# EAGLE design TempestDrone2 (EAGLE 6.6.0)

## Sheet 1 of 3
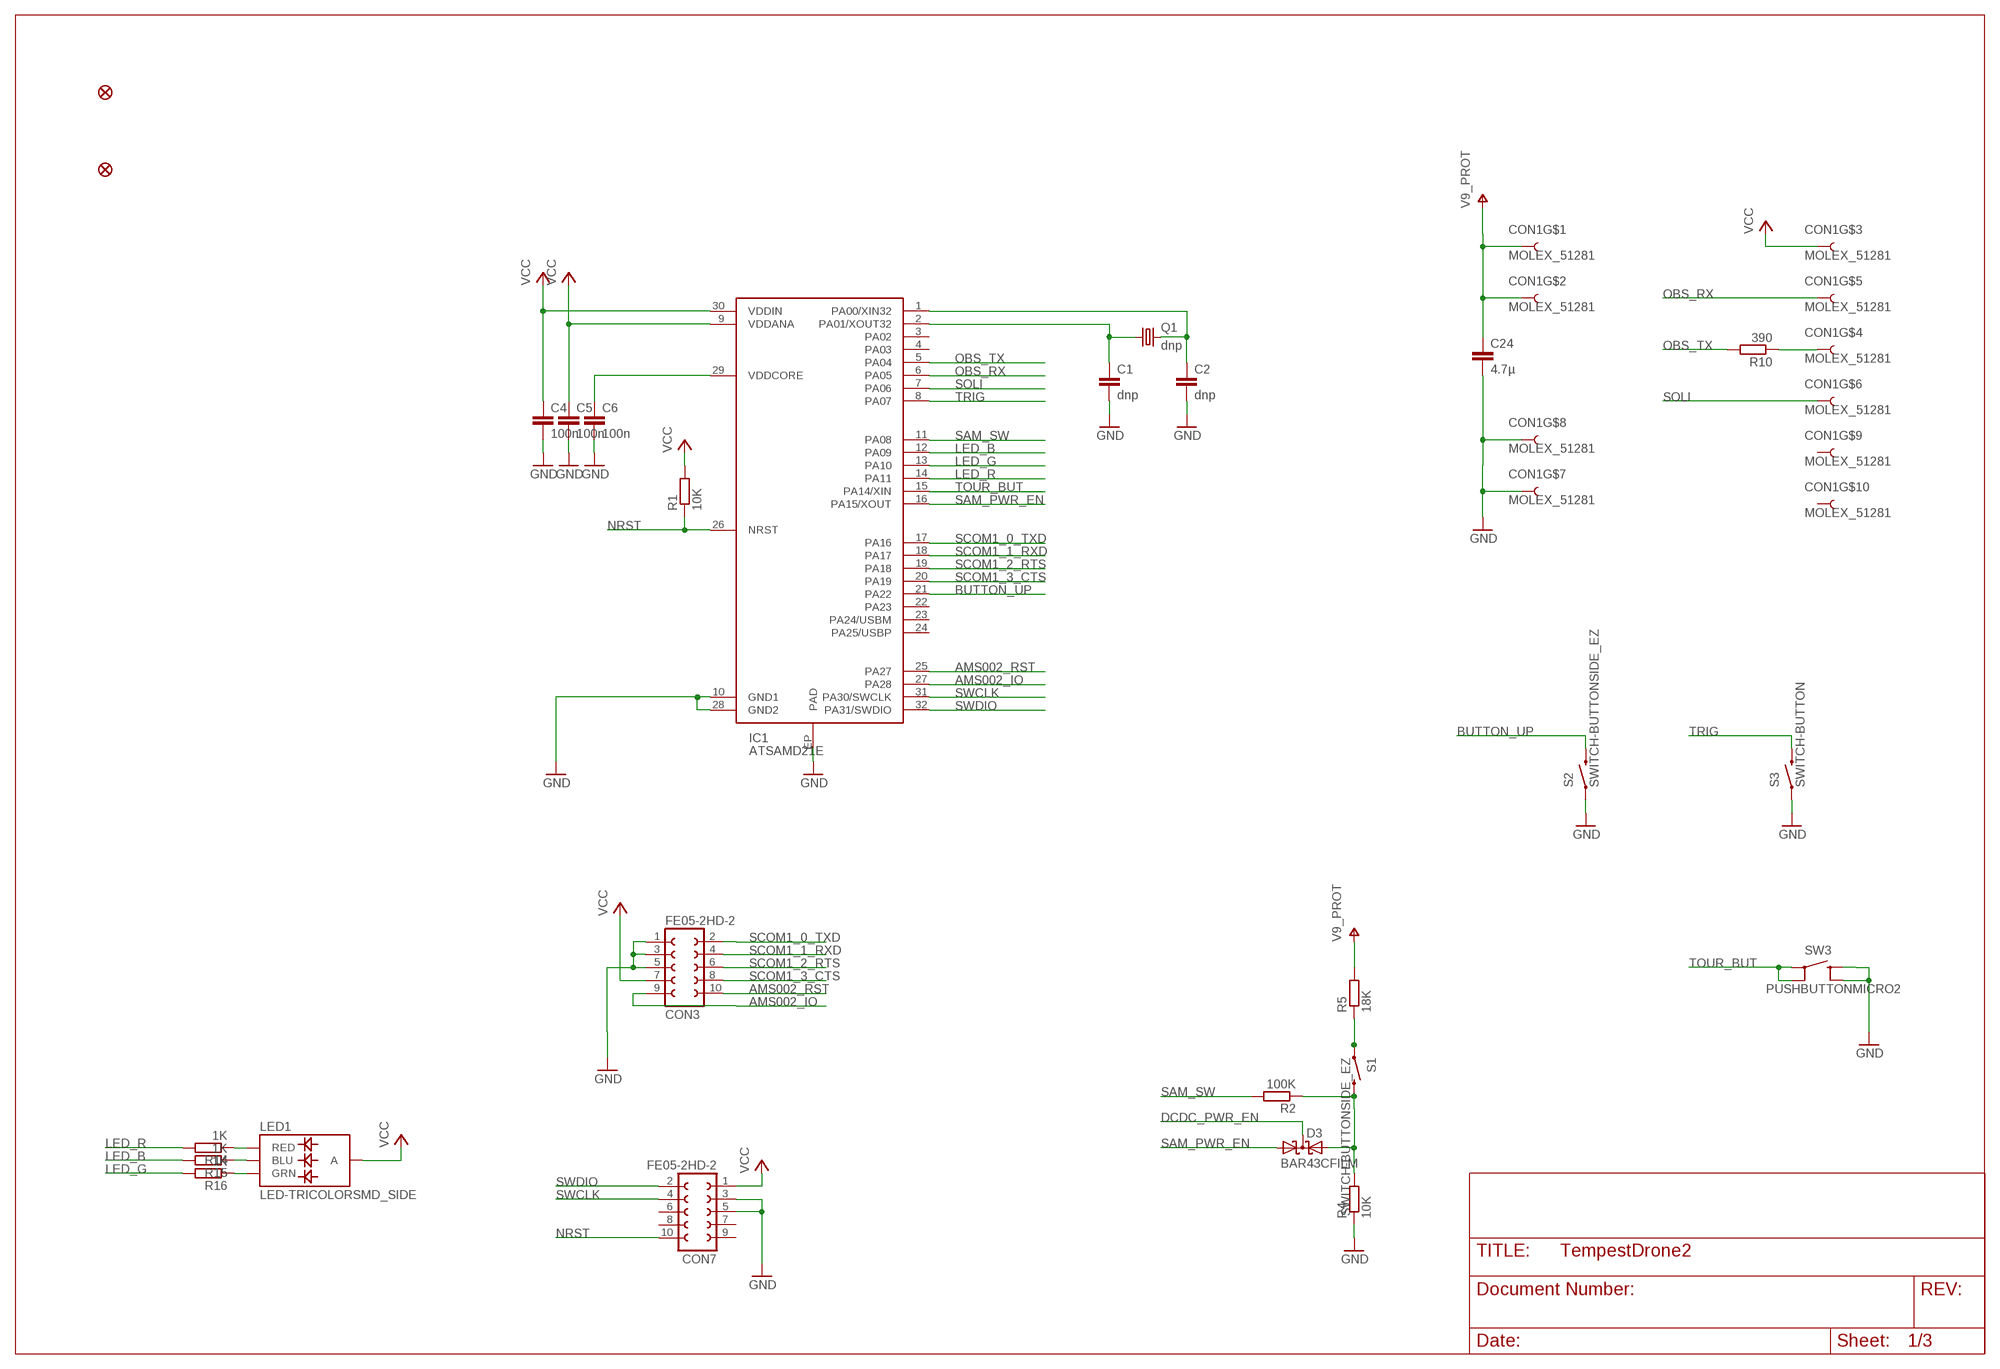
[diagram p0: schematic, sheet 1]

### Parts
C1  dnp  C0603  [_0603MP]
C2  dnp  C0603  [_0603MP]
C4  100n  C0603  [_0603MP]
C5  100n  C0603  [_0603MP]
C6  100n  C0603  [_0603MP]
C24  4.7µ  C-EUC1206  [C1206]
CON1  MOLEX_51281  [MOLEX_51281]
CON3  FE05-2HD-2  [FE02-2-HD-2]
CON7  FE05-2HD-2  [FE02-2-HD-2]
D3  BAR43CFILM  BAT54C  [SOT23]
FID1  FIDUCIALUFIDUCIAL  [MICRO-FIDUCIAL]
FID6  FIDUCIALUFIDUCIAL  [MICRO-FIDUCIAL]
IC1  ATSAMD21E  [QFN-32]
LED1  LED-TRICOLORSMD_SIDE  [RGB-LED-SMD-SIDE]
Q1  dnp  CRYSTAL32X15  [XTAL_32X15]
R1  10K  R0603  [_0603MP]
R2  100K  R0603  [_0603MP]
R4  10K  R0603  [_0603MP]
R5  18K  R0603  [_0603MP]
R10  390  R0603  [_0603MP]
R14  1K  R0603  [_0603MP]
R15  1K  R0603  [_0603MP]
R16  1K  R0603  [_0603MP]
S1  SWITCH-BUTTONSIDE_EZ  [TACTILE-PTH-SIDEEZ]
S2  SWITCH-BUTTONSIDE_EZ  [TACTILE-PTH-SIDEEZ]
S3  SWITCH-BUTTON  [D2F-A]
SW3  PUSHBUTTONMICRO2  [PUSHBUTTON-MICRO2]

### Nets
AMS002_IO: CON3.9 IC1.27(PA28)
AMS002_RST: CON3.10 IC1.25(PA27)
BUTTON_UP: IC1.21(PA22) S2.2
DCDC_PWR_EN: D3.3(CC) ; also sheet 3
GND: C1.2 C2.2 C4.2 C5.2 C6.2 C24.2 CON1.7 CON1.8 CON3.1 CON3.3 CON3.5 CON7.3 CON7.5 IC1.10(GND1) IC1.28(GND2) IC1.EP(PAD) R4.1 S2.1 S3.COM SW3.2A SW3.2B(2A) ; also sheet 3
LED_B: IC1.12(PA09) R15.2
LED_G: IC1.13(PA10) R16.2
LED_R: IC1.14(PA11) R14.2
N$1: C2.1 IC1.1(PA00/XIN32) Q1.2
N$2: C6.1 IC1.29(VDDCORE)
N$3: C1.1 IC1.2(PA01/XOUT32) Q1.1
N$5: D3.2(A2) R2.1 R4.2 S1.2
N$6: CON1.4 R10.1
N$7: R5.1 S1.1
N$30: LED1.1(RED) R14.1
N$31: LED1.3(BLU) R15.1
N$32: LED1.2(GRN) R16.1
NRST: CON7.10 IC1.26(NRST) R1.1
OBS_RX: CON1.5 IC1.6(PA05)
OBS_TX: IC1.5(PA04) R10.2
SAM_PWR_EN: D3.1(A1) IC1.16(PA15/XOUT)
SAM_SW: IC1.11(PA08) R2.2
SCOM1_0_TXD: CON3.2 IC1.17(PA16)
SCOM1_1_RXD: CON3.4 IC1.18(PA17)
SCOM1_2_RTS: CON3.6 IC1.19(PA18)
SCOM1_3_CTS: CON3.8 IC1.20(PA19)
SOLI: CON1.6 IC1.7(PA06)
SWCLK: CON7.4 IC1.31(PA30/SWCLK)
SWDIO: CON7.2 IC1.32(PA31/SWDIO)
TOUR_BUT: IC1.15(PA14/XIN) SW3.1A SW3.1B(1A)
TRIG: IC1.8(PA07) S3.NO
V9_PROT: C24.1 CON1.1 CON1.2 R5.2 ; also sheet 3
VCC: C4.1 C5.1 CON1.3 CON3.7 CON7.1 IC1.9(VDDANA) IC1.30(VDDIN) LED1.4(A) R1.2 ; also sheet 3
Unconnected: CON1.9 CON1.10 CON7.6 CON7.7 CON7.8 CON7.9 IC1.3(PA02) IC1.4(PA03) IC1.22(PA23) IC1.23(PA24/USBM) IC1.24(PA25/USBP)

## Sheet 2 of 3
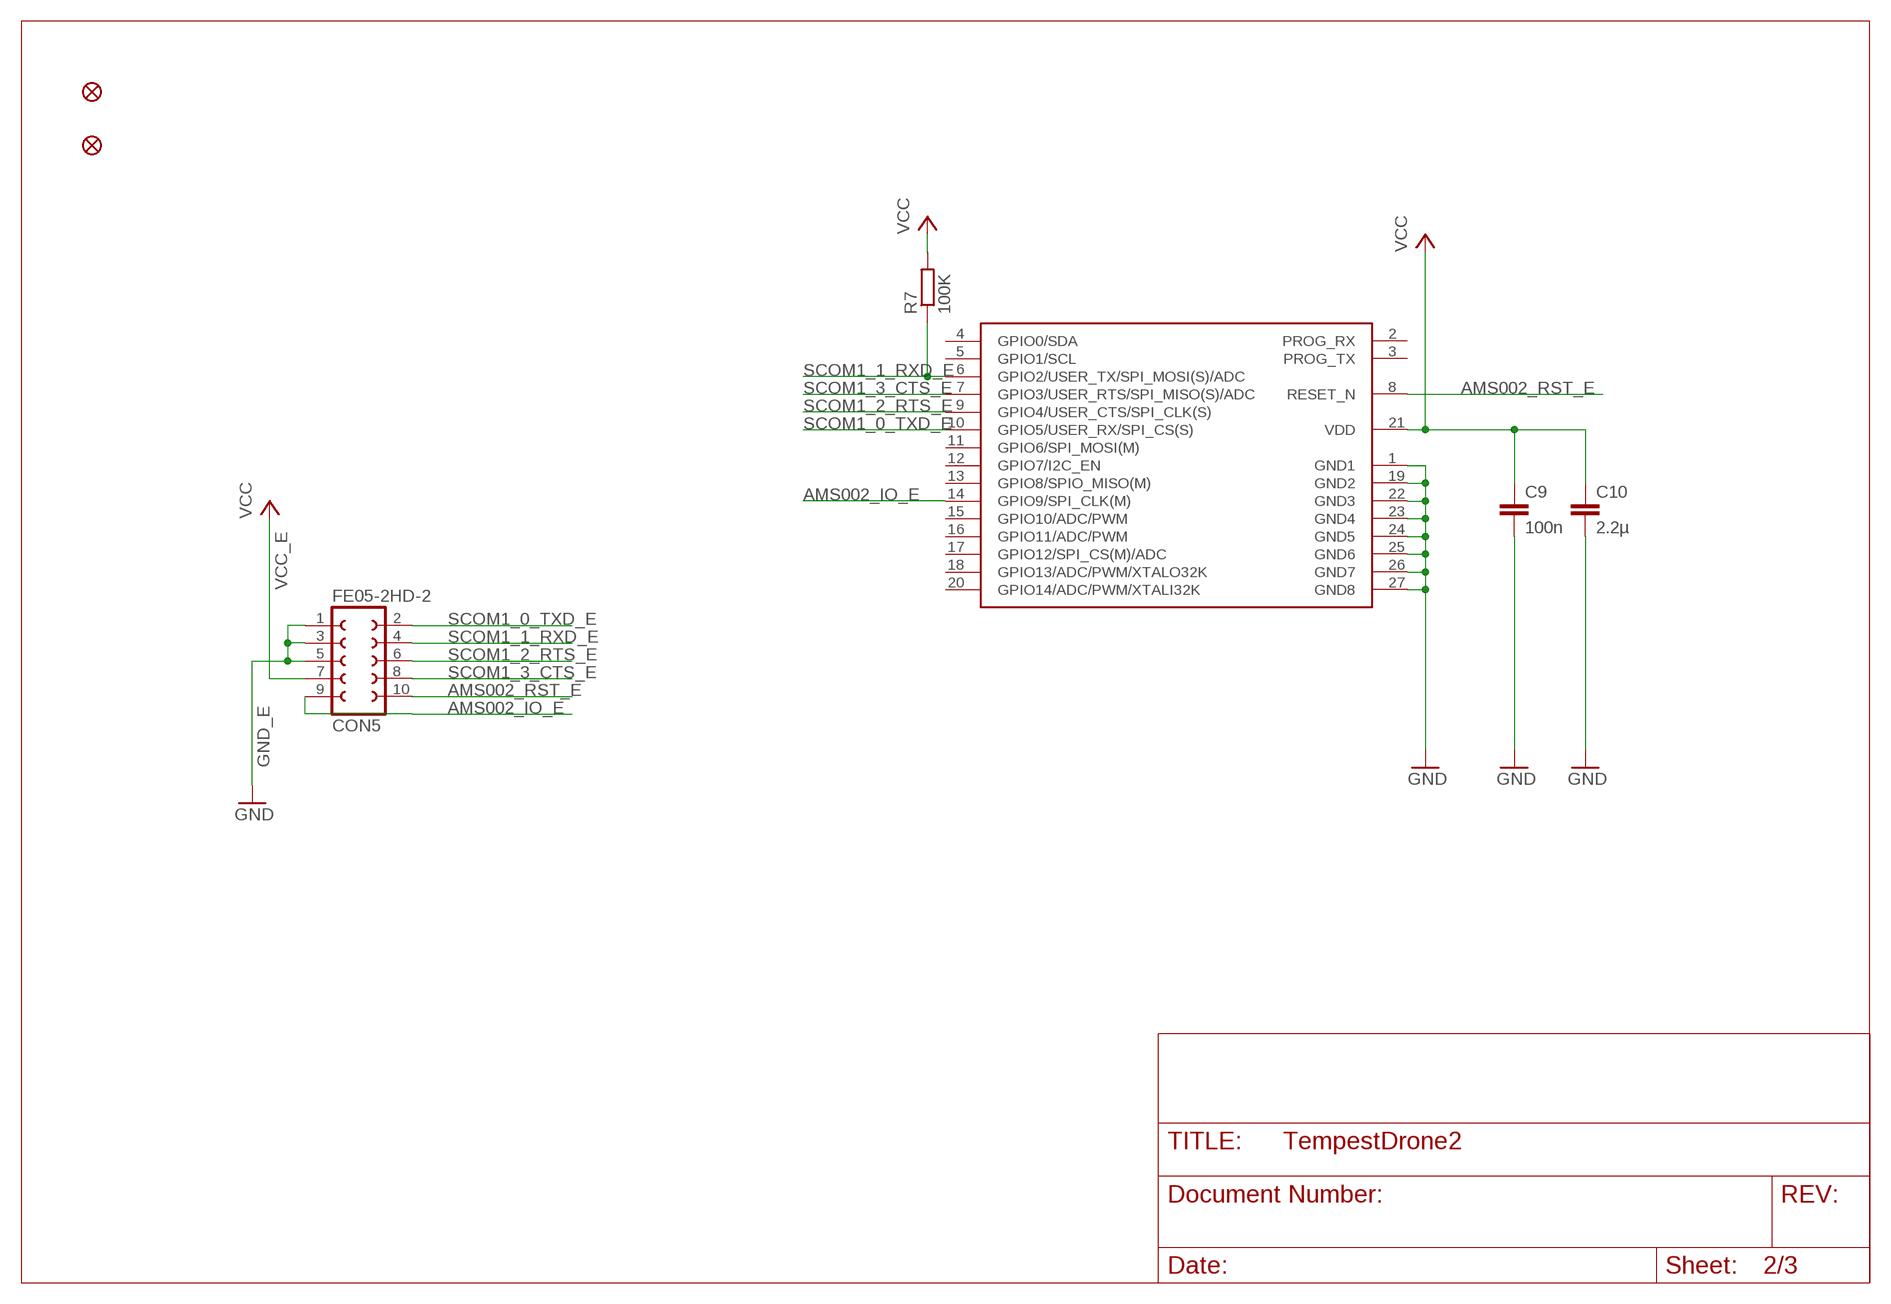
[diagram p1: schematic, sheet 2]

### Parts
C9  100n  C0603  [_0603MP]
C10  2.2µ  C0603  [_0603MP]
CON5  FE05-2HD-2  [FE02-2-HD-2]
FID3  FIDUCIALUFIDUCIAL  [MICRO-FIDUCIAL]
FID5  FIDUCIALUFIDUCIAL  [MICRO-FIDUCIAL]
R7  100K  R0603  [_0603MP]
U$1  AMS002  [AMS00X]

### Nets
AMS002_IO_E: CON5.9 U$1.14(GPIO9/SPI_CLK(M))
AMS002_RST_E: CON5.10 U$1.8(RESET_N)
GND_E: C9.2 C10.2 CON5.1 CON5.3 CON5.5 U$1.1(GND1) U$1.19(GND2) U$1.22(GND3) U$1.23(GND4) U$1.24(GND5) U$1.25(GND6) U$1.26(GND7) U$1.27(GND8) ; supply symbol labelled GND
SCOM1_0_TXD_E: CON5.2 U$1.10(GPIO5/USER_RX/SPI_CS(S))
SCOM1_1_RXD_E: CON5.4 R7.1 U$1.6(GPIO2/USER_TX/SPI_MOSI(S)/ADC)
SCOM1_2_RTS_E: CON5.6 U$1.9(GPIO4/USER_CTS/SPI_CLK(S))
SCOM1_3_CTS_E: CON5.8 U$1.7(GPIO3/USER_RTS/SPI_MISO(S)/ADC)
VCC_E: C9.1 C10.1 CON5.7 R7.2 U$1.21(VDD) ; supply symbol labelled VCC
Unconnected: U$1.2(PROG_RX) U$1.3(PROG_TX) U$1.4(GPIO0/SDA) U$1.5(GPIO1/SCL) U$1.11(GPIO6/SPI_MOSI(M)) U$1.12(GPIO7/I2C_EN) U$1.13(GPIO8/SPIO_MISO(M)) U$1.15(GPIO10/ADC/PWM) U$1.16(GPIO11/ADC/PWM) U$1.17(GPIO12/SPI_CS(M)/ADC) U$1.18(GPIO13/ADC/PWM/XTALO32K) U$1.20(GPIO14/ADC/PWM/XTALI32K)

## Sheet 3 of 3
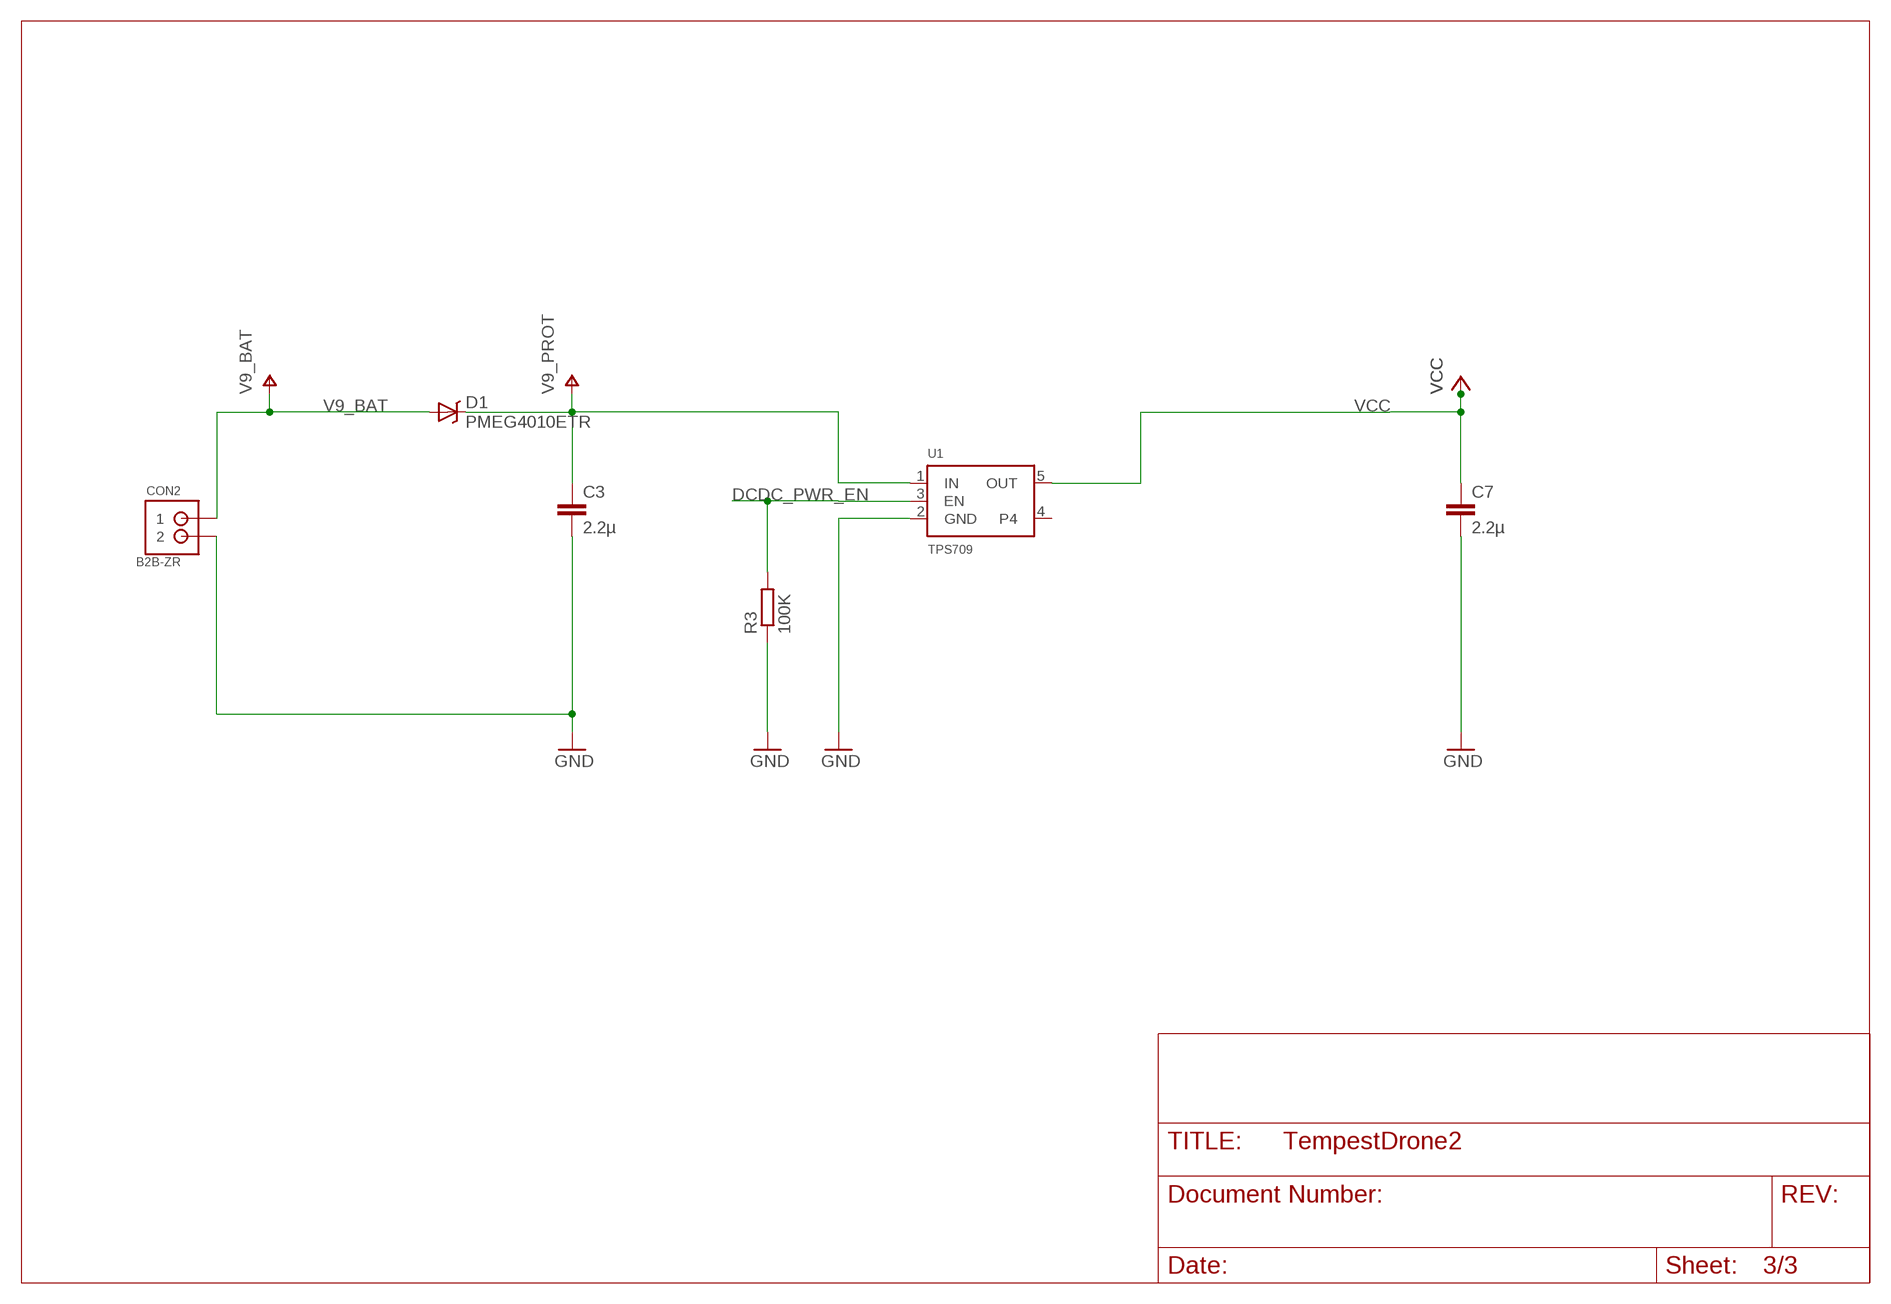
[diagram p2: schematic, sheet 3]

### Parts
C3  2.2µ  C-EUC0805  [C0805]
C7  2.2µ  C-EUC0805  [C0805]
CON2  B2B-ZR  [S2B-ZR]
D1  PMEG4010ETR  DIODE-SCHOTTKYSOD123  [SOD123]
R3  100K  R0603  [_0603MP]
U1  TPS709  VREG_SOT23-5  [SOT23-5]

### Nets
DCDC_PWR_EN: R3.2 U1.3(EN) ; also sheet 1
GND: C3.2 C7.2 CON2.2 R3.1 U1.2(GND) ; also sheet 1
V9_BAT: CON2.1 D1.A
V9_PROT: C3.1 D1.C U1.1(IN) ; also sheet 1
VCC: C7.1 U1.5(OUT) ; also sheet 1
Unconnected: U1.4

## Library data of the parts
C1 C2 C4-C6 C9 C10 = squirrel:C
C3 C7 C24 = squirrel:C-EU: CAPACITOR, European symbol
CON1 = squirrel:MOLEX_51281
CON2 = squirrel:B2B-ZR
CON3 CON5 CON7 = squirrel:FE05-2: FEMALE HEADER
D1 = squirrel:DIODE-SCHOTTKY: Commonly MBRA140.
D3 = diode:BAT54C: Schottky Diodes Source: Fairchild .. BAT54.pdf
FID1 FID3 FID5 FID6 = squirrel:FIDUCIAL: Fiducial Alignment Points Various fiducial points for machine vision alignment.
IC1 = squirrel:ATSAMD21E
LED1 = squirrel:LED-TRICOLOR: Tri-Color LED SMD Proven layout and schematic for triple color LED in SMD package - common anode. Spark Fun Electronics SKU : COM-07844
Q1 = squirrel:CRYSTAL: CRYSTAL
R1-R5 R7 R10 R14-R16 = squirrel:R
S1-S3 = squirrel:SWITCH-BUTTON: Various NO switches- pushbuttons, reed, etc
SW3 = squirrel:PUSHBUTTON
U1 = squirrel:VREG_SOT23-5: SOT23-5 Fixed Voltage Regulators Part Current Out V Out V In V Dropout ?JA (°C/W) TJ (°C) Digikey Part No. ADP121 150mA 3.3V 3.4-5.5V 0.09V @ 150mA -- -- ADP121-AUJZ33R7CT-ND ADP121 150mA 3.0V 3.1-5.5V 0.09V @ 150mA -- -- ADP121-AUJZ30R7CT-ND ADP122 300mA 3.3V 3.4-5.5V 0.085V @ 300mA -- -- ADP122AUJZ-3.3-R7CT-ND ADP1712 300mA 3.3V 3.5-5.5V 0.17V @ 300mA -- -- ADP1712AUJZ-3.3-R7TR-ND AP7311 (Low Cost) 150mA 3.3V 3.5-6V 0.15V @ 150mA -- -- AP7311-33WG-7DICT-ND LD39015M18R 150mA 1.8V 1.9V-5.5V 0.08V @ 100mA -- -- 497-6977-1-ND LP2985A-33DBVR 150mA 3.3V 3.3-16V 0.28V @ 150mA 206 150 296-18479-1-ND MCP1824T-3302E/OT 300mA 3.3V 3.5V-6V 0.2V @ 300mA -- -- MCP1824T-3302E/OTCT-ND MIC5205-2.5YM5 TR 150mA 2.5V 2.7-16V 0.165V @ 150mA -- -- 576-1257-2-ND MIC5205-3.0YM5 TR 150mA 3.0V 3.2V-16V 0.165V @ 150mA -- -- 576-1258-2-ND MIC5205-3.3YM5 TR 150mA 3.3V 3.5V-16V 0.165V @ 150mA -- -- 576-1259-2-ND TPS780330220 150mA 3.3V+2.2V 3.6-5.5V 250mV Max -- -- 296-23332-1-ND TDA3663/N1,135 100mA 3.3V 3.5-45V 0.18V @ 50mA -- -- 568-5343-1-ND Max operating temp can be calculated using ?JA, TJ (max junction temperature), and power in watts. Set the "Maximum Ambient Temperature" until it reaches TJ ("Max Junction Temperature"), which is the absolute limit for safe use of the regulator: Heat Sink Temperature Calculator <http://www.daycounter.com/Calculators/Heat-Sink-Temperature-Calculator.phtml> For example, With 12V source into a 3.3V LP2985 and a 30mA load, we are dissipating (12V-3.3V) * 0.03A = 0.261W. With a ?JA of 206 °C/W, a TJ of 150°C, and 261mW we can safely use the chip without a heat sink up to 75°C (=147.1°C Junction Temperature).
U$1 = AMS00x:AMS002

## Board
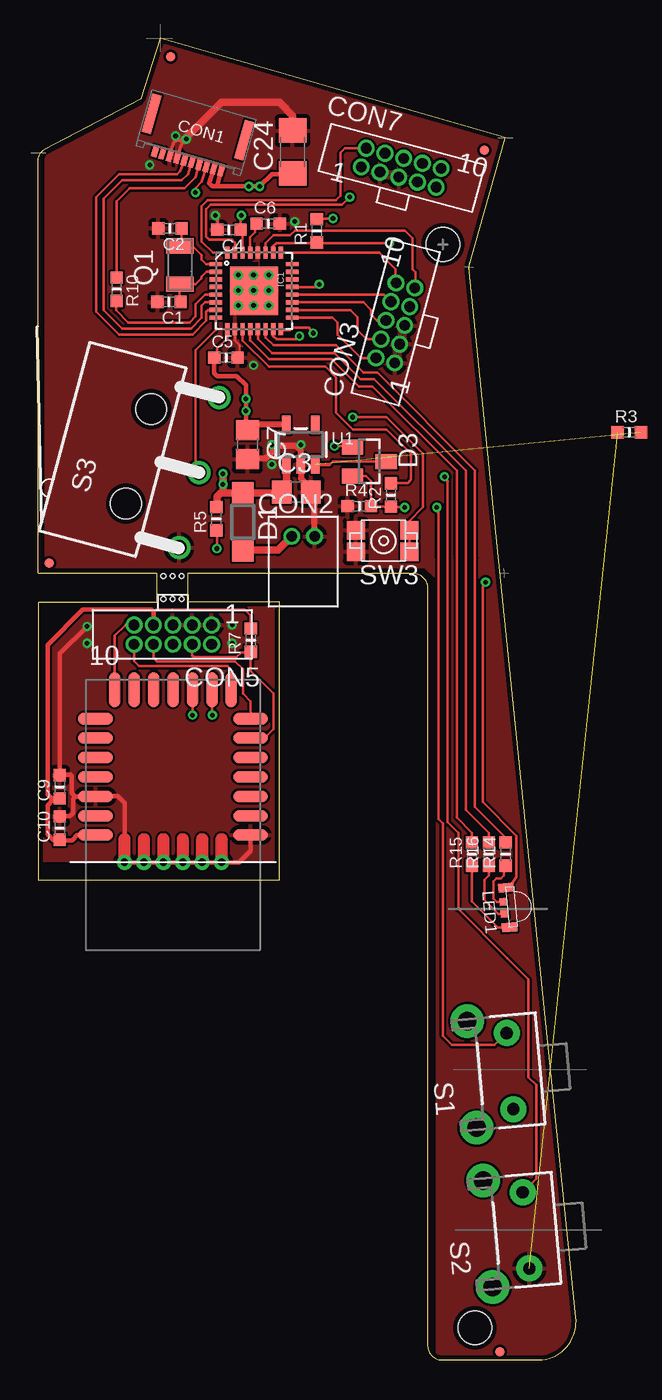
[diagram p3: board, top side]
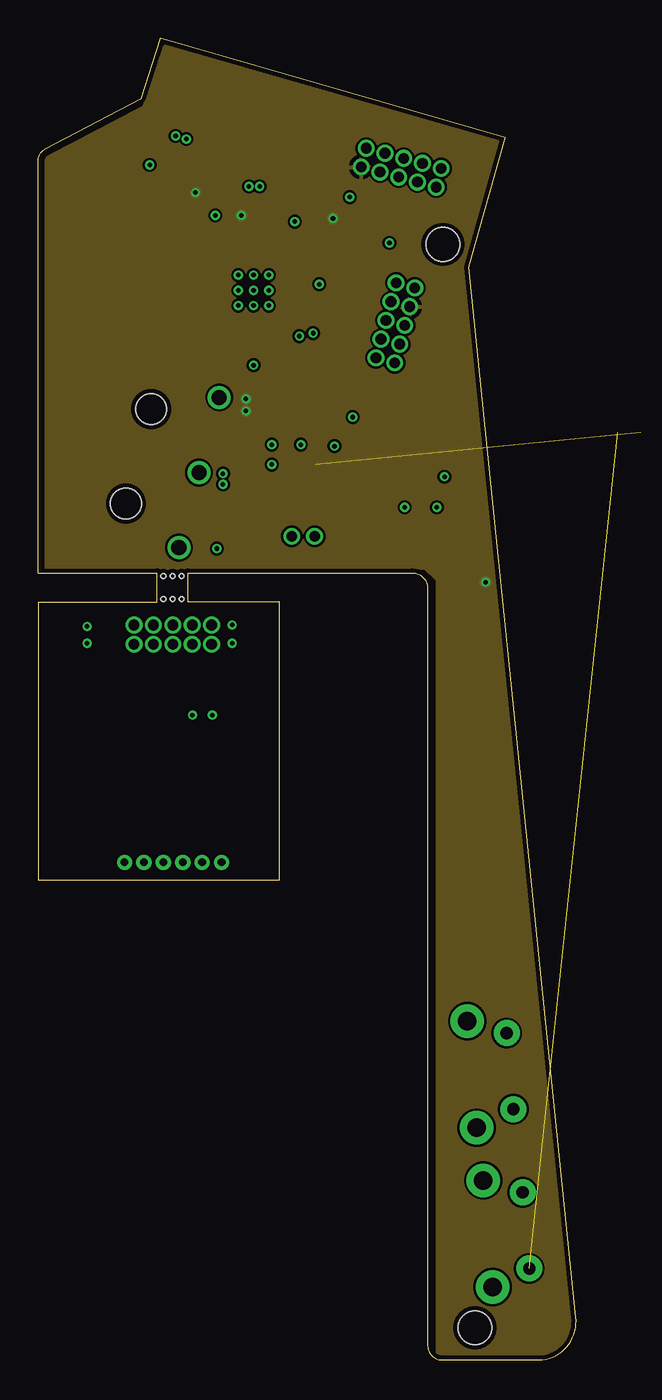
[diagram p4: board, inner layer Route2]
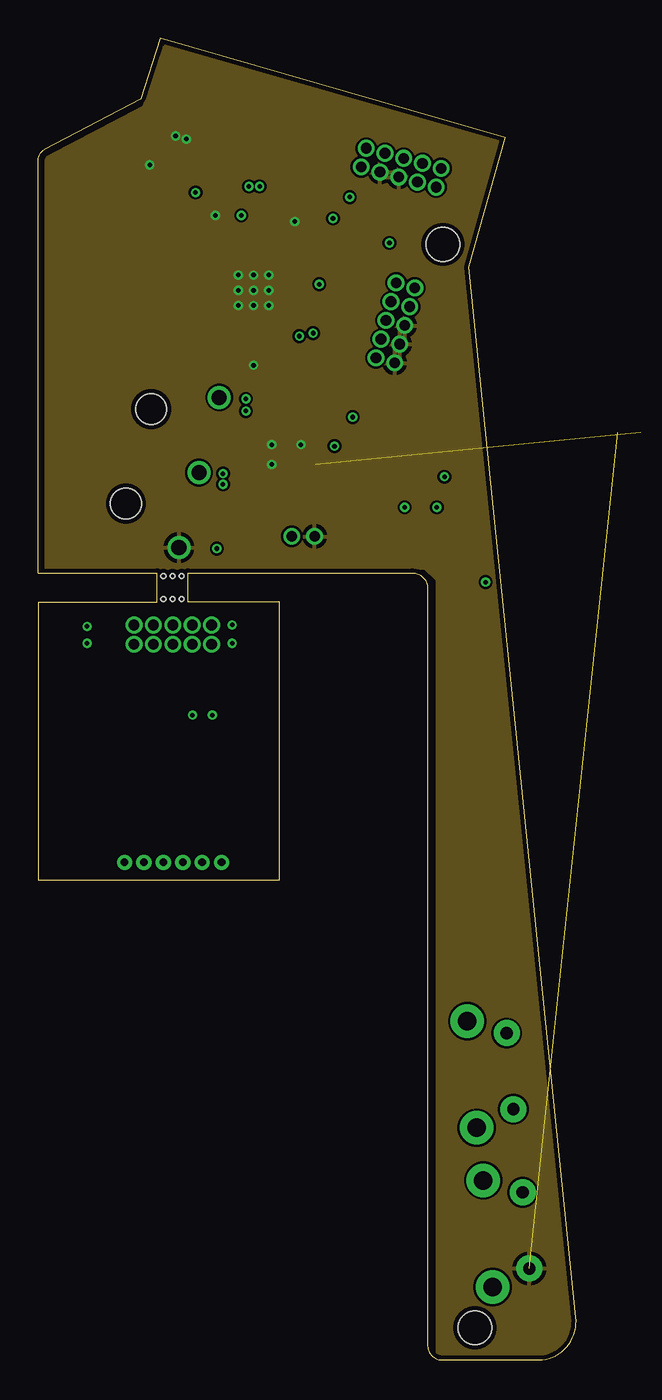
[diagram p5: board, inner layer Route15]
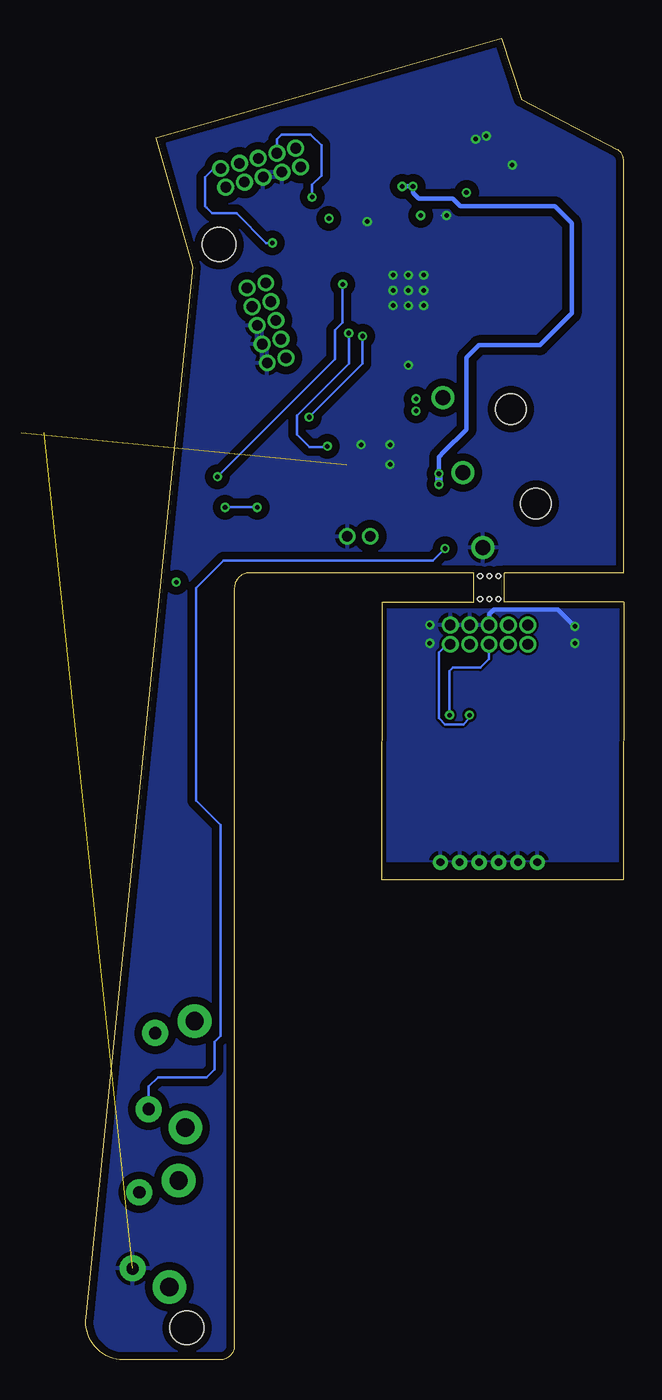
[diagram p6: board, bottom side, seen from below]

Size 35.22 x 86.5 mm. Coordinates in mm from the lower left corner, seen from the top.
Outline: 0,51.5 0.1,51.5 7.8,51.5 7.8,49.6 0,49.6 0.02,31.4 15.81,31.4 15.8,49.6 9.8,49.6 9.8,51.5 24.5,51.5 arc-90 25.5,50.5 25.5,50 25.5,16.2 25.5,0.9 arc90 26.5,0 33,0 arc90 35.2,2.8 28.2,71.5 30.6,80 8,86.5 6.7,82.5 0.4,79.2 arc59 0,78.5 0,78 0,56 0,51.5
Copper layers (1*2+15*16): Top 0.035mm / dielectric 0.45mm / Route2 0.035mm / dielectric 0.45mm / Route15 0.035mm / dielectric 0.45mm / Bottom 0.035mm
Design rules "pcbpool2 *": minimum track width 0.15mm, minimum drill 0.3mm, track to track 0.15mm, track to pad 0.15mm, pad to pad 0.15mm, via to via 0.15mm, smd to smd 0.15mm, copper to edge 0.3mm, drill to drill 8mil, minimum pad ring 0.2mm, minimum via ring 0.15mm, stop-mask expansion 4mil, vias tented up to drill 0mil, thermal gap 10mil
Holes 2.2 mm at 26.5,73 28.6,2.1
Holes 0.3 mm at 8.2,49.8 8.8,49.8 9.4,49.8 8.2,51.3 8.8,51.3 9.4,51.3
tRestrict: area 15.8,69.8 to 16.1,70.1; area 14,68.1 to 14.6,68.3; area 13.9,71.6 to 14.4,71.8; area 12.1,69.7 to 12.5,70.3; area 8.3,71 to 10.2,72.4

### Footprints (pad centres in the part's own frame; a part is rotated, then mirrored left to right if it is on the bottom)
_0603MP = smd 0.8 x 0.8: 1 -0.762,0; 2 0.762,0
C0805 = smd 1.3 x 1.5: 1 -0.95,0; 2 0.95,0
C1206 = smd 1.6 x 1.8: 1 -1.4,0; 2 1.4,0
MOLEX_51281 = smd 0.35 x 0.8: 1 -2.25,2.1; 2 -1.75,2.1; 3 -1.25,2.1; 4 -0.75,2.1; 5 -0.25,2.1; 6 0.25,2.1; 7 0.75,2.1; 8 1.25,2.1; 9 1.75,2.1; 10 2.25,2.1 | smd 0.6 x 2.6: MNT1 -3.15,-0.2; MNT2 3.15,-0.2
S2B-ZR = drill 0.7 pad 1.1: 1 0,-1.3; 2 1.5,-1.3
FE02-2-HD-2 = drill 0.7 pad 1.1: 1 -2.54,0; 2 -2.54,1.27; 3 -1.27,0; 4 -1.27,1.27; 5 0,0; 6 0,1.27; 7 1.27,0; 8 1.27,1.27; 9 2.54,0; 10 2.54,1.27
SOD123 = smd 1.4 x 1.4: A 1.9,0; C -1.9,0
SOT23 = smd 1 x 1.4: 1 -0.95,-1.1; 2 0.95,-1.1; 3 0,1.1
MICRO-FIDUCIAL = smd 0.635 x 0.635: 1 0,0
QFN-32 = smd 0.285 x 0.8: 1 -1.75,-2.5; 2 -1.25,-2.5; 3 -0.75,-2.5; 4 -0.25,-2.5; 5 0.25,-2.5; 6 0.75,-2.5; 7 1.25,-2.5; 8 1.75,-2.5; 17 1.75,2.5; 18 1.25,2.5; 19 0.75,2.5; 20 0.25,2.5; 21 -0.25,2.5; 22 -0.75,2.5; 23 -1.25,2.5; 24 -1.75,2.5 | smd 0.8 x 0.285: 9 2.5,-1.75; 10 2.5,-1.25; 11 2.5,-0.75; 12 2.5,-0.25; 13 2.5,0.25; 14 2.5,0.75; 15 2.5,1.25; 16 2.5,1.75; 25 -2.5,1.75; 26 -2.5,1.25; 27 -2.5,0.75; 28 -2.5,0.25; 29 -2.5,-0.25; 30 -2.5,-0.75; 31 -2.5,-1.25; 32 -2.5,-1.75 | smd 3.15 x 3.15: EP 0,0
RGB-LED-SMD-SIDE = smd 0.5 x 0.5: 1 0.55,-0.4; 2 0.55,0.4 | smd 1 x 0.6: 3 0.3,1.3; 4 0.3,-1.3
XTAL_32X15 = smd 1 x 1.8: 1 -2,0; 2 0.5,0
TACTILE-PTH-SIDEEZ = drill 0.8 pad 1.7: 1 -2.5,0; 2 2.5,0 | drill 1.2 pad 2.2: ANCHOR1 -3.5,2.5; ANCHOR2 3.5,2.5
D2F-A = drill 1: COM 0,-5.08; NC 0,5.08; NO 0,0 | hole 2: -4.1,3.2; -4.1,-3.2
PUSHBUTTON-MICRO2 = smd 1.2 x 1.2: 1A -1.7,0.7; 1B -1.7,-0.7; 2A 1.8,0.7; 2B 1.8,-0.7
SOT23-5 = smd 0.55 x 1.2: 1 -0.95,-1.3; 2 0,-1.3; 3 0.95,-1.3; 4 0.95,1.3; 5 -0.95,1.3
AMS00X = smd 0.762 x 2.286: 1 10.16,10.795; 2 8.89,10.795; 3 7.62,10.795; 4 6.35,10.795; 5 5.08,10.795; 6 3.81,10.795; 7 2.54,10.795; 15 2.54,0.635; 16 3.81,0.635; 17 5.08,0.635; 18 6.35,0.635; 19 7.62,0.635; 20 8.89,0.635; 21 10.16,0.635 | smd 2.286 x 0.762: 8 0.635,9.525; 9 0.635,8.255; 10 0.635,6.985; 11 0.635,5.715; 12 0.635,4.445; 13 0.635,3.175; 14 0.635,1.905 | drill 0.5 pad 1: 22 11.938,2.54; 23 11.938,3.81; 24 11.938,5.08; 25 11.938,6.35; 26 11.938,7.62; 27 11.938,8.89

### Placement (x,y rotation side)
C1  8.57,69.24 180 top
C2  8.63,74.05 180 top
C3  16.9,56.8 0 top
C4  12.49,73.96 180 top
C5  12.29,65.6 0 top
C6  15.06,74.36 0 top
C7  13.7,59.9 270 top
C9  1.42,37.5 90 top
C10  1.42,34.8 90 top
C24  16.66,79.06 90 top
CON1  10.4,80.5 164 top
CON2  16.6,55.2 0 top
CON3  24,67.7 75 top
CON5  8.82,48.1 180 top
CON7  23.61,77.41 345 top
D1  13.4,54.84 270 top
D3  21.68,58.79 270 top
FID1  30.22,0.54 0 top
FID3  29.2,79.18 180 top
FID5  8.68,85.28 180 top
FID6  0.72,52.14 0 top
IC1  14.13,69.96 270 top
LED1  31.05,29.63 185 top
Q1  9.26,72.4 90 top
R1  18.24,73.9 90 top
R2  23.1,56.6 90 top
R3  38.7,60.7 0 top
R4  21.02,55.87 0 top
R5  11.66,55.05 90 top
R7  13.92,47.1 90 top
R10  5.14,70.07 270 top
R14  30.6,33.1 90 top
R15  28.4,33.1 90 top
R16  29.5,33.1 90 top
S1  30.89,18.9 95 top
S2  31.94,8.48 95 top
S3  10.53,58.07 345 top
SW3  22.61,53.6 180 top
U1  17.2,59.9 0 top
U$1  3.12,44.5 270 top

### Tracks (layer width: path | path; a pad name or v marks a point on that pad's centre or on a via)
AMS002_IO
  Top 0.15: IC1.27 14.88,73.08 15.4,73.6 16.5,73.6 16.8,73.9 24,73.9 24.5,73.4 24.5,72.1 24.5,71.4 24.7,71.2 24.7,70.2 CON3.9
AMS002_IO_E
  Top 0.15: U$1.14 5.02,47.41 5.72,48.1 CON5.9
AMS002_RST
  Top 0.15: IC1.25 22.25,72.46 22.34,72.46 23.4,71.4 23.4,70.51 CON3.10
AMS002_RST_E
  Top 0.15: CON5.10 6.28,45.73 6.6,45.4 12.4,45.4 12.7,45.1 12.7,43.93 U$1.8
BUTTON_UP  (via drill 0.3)
  Top 0.15: IC1.21 18.21,70.21 v18.4,70.4 | 26.8,57.5 26.8,52.5 26.8,35.2 27.5,34.5 27.5,29.5 30.72,26.28 32.1,24.9 32.1,18.5 32.6,18 32.6,11.85 S2.2
  Top 0.2: v26.6,57.8 26.6,57.7 26.8,57.5
  Bottom 0.15: v18.4,70.4 18.4,67.9 18.9,67.4 18.9,65.5 v26.6,57.8
DCDC_PWR_EN  (1 unrouted)
  Top 0.15: 19.1,58.6 19.3,58.8 D3.3
  Top 0.2: U1.3 19.1,58.6
GND  (via drill 0.3)  (1 unrouted)
  Top 0.15: IC1.10 12.88,66.72 13.2,66.4 13.2,65.75 C5.2 | C4.2 11.73,74.83 v11.6,74.9
  Top 0.2: CON1.8 8.9,79.7 9.1,79.8 9.5,79.8 CON1.7
  Top 0.4: 18.1,56.45 18.1,56.8 17.2,57.7 U1.2 17.2,59.5 16.9,59.8 15.7,59.8 14.9,59 13.75,59 C7.2 | 18.1,56.45 18.1,55.95 C3.2 18.1,56.45 | CON2.2 18.1,56.45
  Top 0.5: C24.2 16.66,81.44 15.8,82.3 12,82.3 9.5,79.8
  Bottom 0.15: v11.6,74.9 11.9,74.9
  other vias: 16.8,74.5 13.1,71 14.1,71 15.1,71 14.1,70 15.1,70 13.1,70 13.1,69 14.1,69 15.1,69 14.1,65.1 7.3,78.2 9,80.1 9.7,79.9 17.2,59.9 15.3,59.9 15.3,58.6
  pour Top: 8.2,85.9 6.9,82.1 0.6,78.8 0.5,78.6 0.5,51.9 25.3,51.9 26.1,51.1 26.1,0.1 34.4,0.1 35.1,0.8 28,71.4 28,71.8 30.3,79.9 8.3,86.1 8.2,86
  pour Bottom (isolate 0.5): 8.2,85.9 6.9,82.1 0.6,78.8 0.5,78.6 0.5,51.9 25.3,51.9 26.1,51.1 26.1,0.1 34.4,0.1 35.1,0.8 28,71.4 28,71.8 30.3,79.9 8.3,86.1 8.2,86
  pour Route15: 8.2,85.8 6.9,82 0.6,78.7 0.5,78.5 0.5,51.8 25.3,51.8 26.1,51 26.1,0 34.4,0 35.1,0.7 28,71.3 28,71.7 30.3,79.8 8.3,86 8.2,85.9
GND_E  (via drill 0.3)
  Top 0.3: 2.48,36.88 U$1.19 3.77,36.9 5.2,36.9 5.65,36.45 U$1.22 U$1.23 U$1.24 U$1.25 U$1.26 U$1.27 13.16,32.56 13.9,33.3 U$1.1 | 2.48,36.88 2.3,36.7 2.3,35.8 2.1,35.6 1.55,35.6 C10.2 | v3.2,48 1.42,46.22 C9.2 1.55,38.3 2.1,38.3 2.2,38.2 2.2,37.1 2.42,36.88 2.48,36.88
  Bottom 0.3: v3.2,48 4.3,49.1 8.5,49.1 8.8,48.8 8.8,48.02 CON5.5
  other vias: 3.2,46.9 12.7,48.1 12.7,46.9
  pour Top: 0.1,49.3 15.8,49.3 15.8,31.5 0.1,31.5
  pour Bottom: 0.1,49.1 15.8,49.1 15.8,31.5 0.1,31.5
LED_B
  Top 0.15: R15.2 28.4,34.5 27.4,35.5 27.4,52.5 27.4,58.2 21.9,63.7 21,63.7 19.2,65.5 17.9,65.5 15.1,65.5 13.9,66.7 13.88,66.72 IC1.12
LED_G
  Top 0.15: R16.2 29.5,34.5 28,36 28,52.5 28,58.2 22,64.2 21.1,64.2 19.4,65.9 17.5,65.9 15.3,65.9 14.4,66.8 14.38,66.82 IC1.13
LED_R
  Top 0.15: IC1.14 14.9,67.45 14.9,66.9 15.4,66.4 17.4,66.4 17.7,66.4 19.5,66.4 21.3,64.6 22.2,64.6 28.6,58.2 28.6,52.5 28.6,36.2 30.6,34.2 R14.2
N$1
  Top 0.15: IC1.1 10.99,71.71 10.7,72 10.7,72.3 10.1,72.9 Q1.2 9.39,73.03 C2.1
N$2
  Top 0.15: IC1.29 13.88,73.48 14.2,73.8 14.2,74.26 C6.1
N$3
  Top 0.15: C1.1 9.26,69.31 Q1.1 10.3,70.4 10.7,70.8 10.7,70.9 11.01,71.21 IC1.2
N$5  (via drill 0.3)
  Top 0.15: v26.1,55.8 26.2,55.8 26.2,52.5 26.2,35.4 26.5,35.1 26.5,21.2 27.1,20.6 29.88,20.6 S1.2 | v24,55.8 23.14,55.8 R2.1 21.82,55.84 R4.2 21.8,55.89 21.8,57.5 21.46,57.84 D3.2
  Bottom 0.15: v26.1,55.8 v24,55.8
N$6
  Top 0.15: R10.1 5.14,75.84 6,76.7 9.6,76.7 10.3,77.4 CON1.4
N$7  (via drill 0.3)
  Top 0.15: v11.7,53.1 11.7,54.25 R5.1
  Bottom 0.15: S1.1 31.1,17.9 30.5,18.5 27.3,18.5 26.8,19 26.8,20.8 26.4,21.2 26.4,35 28,36.6 28,50.5 26.2,52.3 12.5,52.3 v11.7,53.1
N$30
  Top 0.15: LED1.1 30.02,29.98 29.8,30.2 29.8,31.3 30,31.5 30.3,31.5 30.5,31.7 30.5,32.24 R14.1
N$31
  Top 0.15: LED1.3 30.09,28.31 28.4,30 R15.1
N$32
  Top 0.15: LED1.2 30.11,29.19 29.5,29.8 29.2,30.1 29.2,31.4 29.5,31.7 R16.1
NRST  (via drill 0.3)
  Top 0.15: IC1.26 15.38,72.88 15.6,73.1 | 15.6,73.1 v23,73.1 | 15.6,73.1 18.2,73.1 R1.1
  Bottom 0.15: CON7.10 26.82,77.98 27.4,77.4 27.4,75.5 27.3,75.4 26.94,75.04 26.86,75.04 25.36,75.04 23.42,73.1 v23,73.1
OBS_RX
  Top 0.15: IC1.6 10.91,69.21 10.7,69 10.7,68.2 10,67.5 5.5,67.5 4.3,68.7 4.3,76 5.5,77.2 9.4,77.2 9.8,77.6 CON1.5
OBS_TX
  Top 0.15: IC1.5 10.91,69.71 10.3,69.1 10.3,68.3 9.9,67.9 5.9,67.9 5.1,68.7 5.1,69.27 R10.2
SAM_PWR_EN  (via drill 0.3)
  Top 0.15: v18,67.2 17.74,67.56 16.66,67.56 16.5,67.4 15.95,67.4 IC1.16 | v19.4,59.8 20.52,59.8 D3.1
  Bottom 0.15: v18,67.2 18,65.2 21.4,61.8 21.4,60.57 D3.1 19.46,59.74 v19.4,59.8
SAM_SW
  Top 0.15: IC1.11 13.38,66.72 15.1,65 18.8,65 19.5,64.3 19.5,62 20.6,60.9 22.8,60.9 24.4,59.3 24.4,57.6 24.2,57.4 23.14,57.4 R2.2
SCOM1_0_TXD
  Top 0.15: IC1.17 19.28,68.21 19.6,67.89 19.6,67.1 21.12,65.58 CON3.2
SCOM1_0_TXD_E  (via drill 0.3)
  Top 0.15: v10.1,42.2 U$1.10 | U$1.10
  Bottom 0.15: CON5.2 11.57,46.83 12.1,46.3 12.1,42 11.7,41.6 10.5,41.6 10.1,42 v10.1,42.2
SCOM1_1_RXD
  Top 0.15: IC1.18 20.43,68.71 20.9,68.25 20.9,67.4 21.5,66.8 CON3.4
SCOM1_1_RXD_E
  Top 0.15: U$1.6 14.02,40.8 14.92,40.8 15.42,41.3 15.42,43.6 13.92,45.1 R7.1 13.88,46.3 13.3,46.3 13,46 10.2,46 10.08,46.12 CON5.4
SCOM1_2_RTS
  Top 0.15: IC1.19 21.29,69.21 21.8,68.7 21.8,68.4 22.17,68.03 CON3.6
SCOM1_2_RTS_E  (via drill 0.3)
  Top 0.15: v11.4,42.2 11.4,43.84 U$1.9
  Bottom 0.15: CON5.6 8.81,45.89 9.4,45.3 11.2,45.3 11.4,45.1 v11.4,42.2
SCOM1_3_CTS
  Top 0.15: IC1.20 22.64,69.71 CON3.8
SCOM1_3_CTS_E
  Top 0.15: CON5.8 7.54,45.96 7.8,45.7 12.9,45.7 13.4,45.2 13.4,43.6 13.9,43.1 U$1.7
SOLI
  Top 0.15: IC1.7 11.11,68.71 11,68.6 11,68 10.1,67.1 5.3,67.1 3.8,68.6 3.8,76.1 5.3,77.6 9.1,77.6 9.3,77.8 CON1.6
SWCLK  (via drill 0.3)
  Top 0.15: IC1.31 12.88,73.12 12.7,73.3 11.7,73.3 11.2,73.3 11.1,73.4 11,73.5 11,75.3 11.3,75.6 19.9,75.6 v20.4,76.1
  Bottom 0.15: v20.4,76.1 20.4,76.9 19.8,77.5 19.8,79.5 20.5,80.2 22.4,80.2 22.7,79.9 CON7.4
  Bottom 0.2: CON7.4
SWDIO
  Top 0.15: IC1.32 12.04,72.46 11.44,72.46 10.7,73.2 10.7,73.8 10.7,75.5 11.1,75.9 19.5,75.9 19.8,76.2 19.8,78.5 19.8,79 20.1,79.3 CON7.2
TOUR_BUT  (via drill 0.3)
  Top 0.15: 21.2,61.7 22.8,61.7 25.2,59.3 25.2,55.8 24.31,54.91 SW3.1B SW3.1A | 21.2,61.7 21.1,61.7 | IC1.15 15.38,67.02 15.6,66.8 17,66.8 v17.1,67 | v20.6,61.7 21.2,61.7
  Bottom 0.15: v17.1,67 17.1,65.2 v20.6,61.7
TRIG
  Top 0.15: IC1.8 11.6,68.18 11.6,67.4 10.3,66.1 10.3,58.3 S3.NO
V9_BAT
  Top 0.4: 13.46,53 D1.A
  Top 0.5: CON2.1 15.7,53 13.46,53
V9_PROT  (via drill 0.3)
  Top 0.15: 16.6,77.6 C24.1
  Top 0.3: CON1.2 11.2,77 11.4,76.8 11.7,76.8 | 11.7,76.8 v13.8,76.8 | v13.8,76.8 14.2,76.8 | 14.2,76.8 v14.5,76.8 15.3,77.6 16.6,77.6 | CON1.1 11.7,76.8 | 14.2,76.8 v13.8,76.8
  Top 0.4: 15.41,56.74 C3.1 | 12.1,56.74 11.94,56.74 | 11.7,55.86 R5.2
  Top 0.5: 15.41,56.74 D1.C 12.1,56.74 v12.1,57.3 v12.1,58 | 11.94,56.74 11.7,56.5 11.7,55.86 | U1.1 16.25,57.1 C3.1
  Bottom 0.3: v14.5,76.8 v13.8,76.8 13.8,76.4 13.4,76 11.2,76 10.7,75.5 4.5,75.5 3.4,74.4 3.4,68.5 5.5,66.4 9.5,66.4 10.3,65.6 10.3,60.9 11.8,59.4 12.1,59.1 v12.1,58
  Bottom 0.5: v12.1,58 v12.1,57.3
VCC  (via drill 0.3)
  Top 0.15: IC1.9 12.38,66.88 11.7,66.2 11.7,65.72 C5.1 | IC1.30 13.38,74.23 C4.1 13.26,75.06 v13.3,74.9 | LED1.4 30.8,30.9 31.3,31.6 31.3,34.3 29.1,36.5 29.1,50.6 v29.3,50.9 | CON1.3 10.7,77.1 10.3,76.7 v10.3,76.4 | R1.2 18.28,74.7 v19.3,74.7
  Top 0.3: C5.1 11.53,64.57 11.7,64.4 13,64.4 13.6,63.8 | 13.6,63.8 v13.6,62.9 | v13.6,62.9 13.6,60.95 C7.1 | 13.6,63.8 v13.6,62.9
  Top 0.4: U1.5 14.05,61.2 C7.1
  Bottom 0.15: v13.3,74.9 13.4,74.9
  other vias: 13.6,62.1
  pour Route2: 8.2,85.8 6.9,82 0.6,78.7 0.5,78.5 0.5,51.8 25.3,51.8 26.1,51 26.1,0 34.4,0 35.1,0.7 28,71.3 28,71.7 30.3,79.8 8.3,86 8.2,85.9
VCC_E
  Top 0.15: 7.54,48.93 7.56,48.95 7.72,49.1 13.51,49.1 13.92,48.7 R7.2 | 1.55,34 C10.1 | 1.38,36.6 C9.1
  Top 0.3: CON5.7 7.54,48.93 | U$1.21 2.56,34.34 2.22,34 1.55,34 | C10.1 0.98,34.04 0.62,34.4 0.62,36.3 0.92,36.6 1.38,36.6 | C9.1 0.88,36.74 0.62,37 0.62,46.8 2.92,49.1 7.42,49.1 7.56,48.95